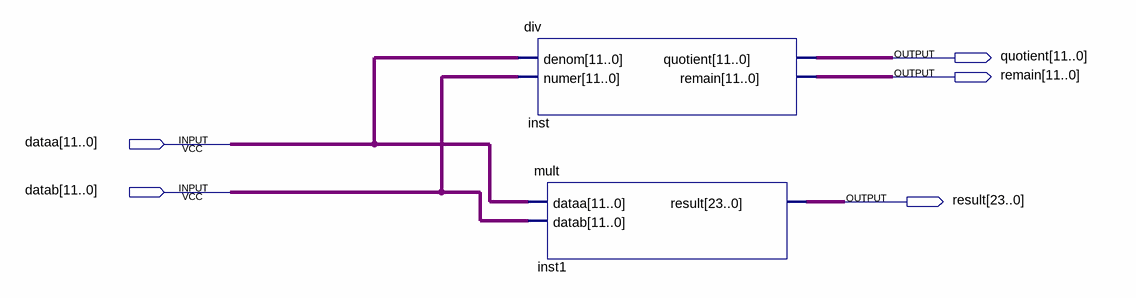
[diagram p0: schematic sheet]
// Quartus schematic div_mult_test.bdf as structural Verilog: 2 symbols, 5 pins
module div_mult_test (
  input  [11:0] dataa,
  input  [11:0] datab,
  output [11:0] quotient,
  output [11:0] remain,
  output [23:0] result
);

  div inst (.denom(dataa), .numer(datab), .quotient(quotient), .remain(remain));
  mult inst1 (.dataa(dataa), .datab(datab), .result(result));
endmodule
